# EAGLE design Esquema (EAGLE 9.6.2)
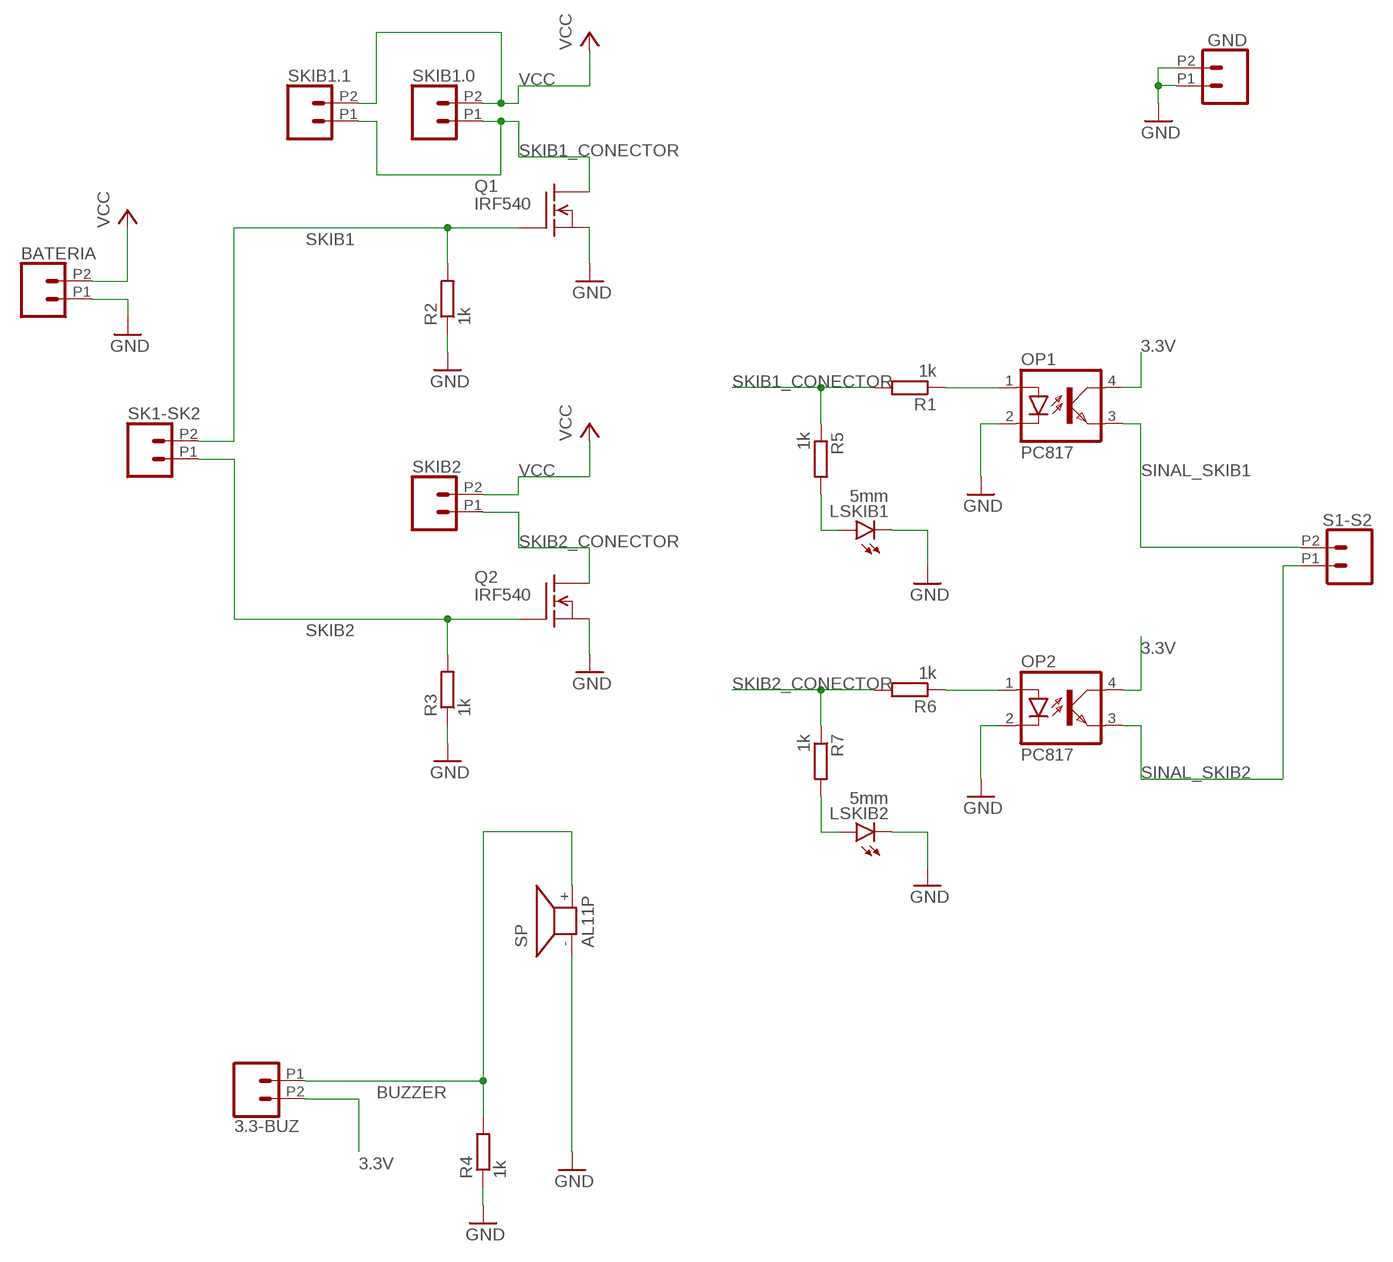
[diagram p0: schematic, sheet 1]

## Parts
3.3-BUZ  CONN_022.54MM_SCREWTERM  [1X02_2.54_SCREWTERM]
BATERIA  CONN_022.54MM_SCREWTERM  [1X02_2.54_SCREWTERM]
GND  CONN_022.54MM_SCREWTERM  [1X02_2.54_SCREWTERM]
LSKIB1  5mm  LED5MM  [LED5MM]
LSKIB2  5mm  LED5MM  [LED5MM]
OP1  PC817  [DIL04]
OP2  PC817  [DIL04]
Q1  IRF540  [TO220]
Q2  IRF540  [TO220]
R1  1k  R-EU_0207/10  [0207/10]
R2  1k  R-EU_0207/10  [0207/10]
R3  1k  R-EU_0207/10  [0207/10]
R4  1k  R-EU_0207/10  [0207/10]
R5  1k  R-EU_0207/10  [0207/10]
R6  1k  R-EU_0207/10  [0207/10]
R7  1k  R-EU_0207/10  [0207/10]
S1-S2  CONN_022.54MM_SCREWTERM  [1X02_2.54_SCREWTERM]
SK1-SK2  CONN_022.54MM_SCREWTERM  [1X02_2.54_SCREWTERM]
SKIB1.0  CONN_022.54MM_SCREWTERM  [1X02_2.54_SCREWTERM]
SKIB1.1  CONN_022.54MM_SCREWTERM  [1X02_2.54_SCREWTERM]
SKIB2  CONN_022.54MM_SCREWTERM  [1X02_2.54_SCREWTERM]
SP  AL11P  [AL11P]

## Nets
3.3V: 3.3-BUZ.P2 OP1.4(COL) OP2.4(COL)
BUZZER: 3.3-BUZ.P1 R4.2 SP.+
GND: BATERIA.P1 GND.P1 GND.P2 LSKIB1.K(C) LSKIB2.K(C) OP1.2(C) OP2.2(C) Q1.3(S) Q2.3(S) R2.1 R3.1 R4.1 SP.-
N$1: LSKIB2.A R7.2
N$3: LSKIB1.A R5.2
N$4: OP1.1(A) R1.1
N$5: OP2.1(A) R6.1
SINAL_SKIB1: OP1.3(EMIT) S1-S2.P2
SINAL_SKIB2: OP2.3(EMIT) S1-S2.P1
SKIB1: Q1.1(G) R2.2 SK1-SK2.P2
SKIB1_CONECTOR: Q1.2(D) R1.2 R5.1 SKIB1.0.P1 SKIB1.1.P1
SKIB2: Q2.1(G) R3.2 SK1-SK2.P1
SKIB2_CONECTOR: Q2.2(D) R6.2 R7.1 SKIB2.P1
VCC: BATERIA.P2 SKIB1.0.P2 SKIB1.1.P2 SKIB2.P2

## Library data of the parts
3.3-BUZ BATERIA GND S1-S2 SK1-SK2 SKIB1.0 SKIB1.1 SKIB2 = SparkFun-Connectors:CONN_02: Multi connection point. Often used as Generic Header-pin footprint for 0.1 inch spaced/style header connections On any of the 0.1 inch spaced packages, you can populate with these: Break Away Headers - Straight <https://www.sparkfun.com/products/116> (PRT-00116) Break Away Male Headers - Right Angle <https://www.sparkfun.com/products/553> (PRT-00553) Female Headers <https://www.sparkfun.com/products/115> (PRT-00115) Break Away Headers - Machine Pin <https://www.sparkfun.com/products/117> (PRT-00117) Break Away Female Headers - Swiss Machine Pin <https://www.sparkfun.com/products/743> (PRT-00743) For SCREWTERMINALS and SPRING TERMINALS visit here: Screw Terimnals on SparkFun.com <https://www.sparkfun.com/search/results?term=Screw+Terminals> (5mm/3.5mm/2.54mm spacing) This device is also useful as a general connection point to wire up your design to another part of your project. Our various solder wires solder well into these plated through hole pads. Hook-Up Wire - Assortment (Stranded, 22 AWG) <https://www.sparkfun.com/products/11375> (PRT-11375) Hook-Up Wire - Assortment (Solid Core, 22 AWG) <https://www.sparkfun.com/products/11367> (PRT-11367) View the entire wire category on our website here <https://www.sparkfun.com/categories/141> Special notes: Molex polarized connector foot print use with: PRT-08233 with associated crimp pins and housings. 2.54_SCREWTERM for use with PRT-10571. 3.5mm Screw Terminal footprints for PRT-08084 5mm Screw Terminal footprints for use with PRT-08432
LSKIB1 LSKIB2 = led:LED: LED OSRAM: - CHIPLED LG R971, LG N971, LY N971, LG Q971, LY Q971, LO R971, LY R971 LH N974, LH R974 LS Q976, LO Q976, LY Q976 LO Q996 - Hyper CHIPLED LW Q18S LB Q993, LB Q99A, LB R99A - SideLED LS A670, LO A670, LY A670, LG A670, LP A670 LB A673, LV A673, LT A673, LW A673 LH A674 LY A675 LS A676, LA A676, LO A676, LY A676, LW A676 LS A679, LY A679, LG A679 - Hyper Micro SIDELED® LS Y876, LA Y876, LO Y876, LY Y876 LT Y87S - SmartLED LW L88C, LW L88S LB L89C, LB L89S, LG L890 LS L89K, LO L89K, LY L89K LS L896, LA L896, LO L896, LY L896 - TOPLED LS T670, LO T670, LY T670, LG T670, LP T670 LSG T670, LSP T670, LSY T670, LOP T670, LYG T670 LG T671, LOG T671, LSG T671 LB T673, LV T673, LT T673, LW T673 LH T674 LS T676, LA T676, LO T676, LY T676, LB T676, LH T676, LSB T676, LW T676 LB T67C, LV T67C, LT T67C, LS T67K, LO T67K, LY T67K, LW E67C LS E67B, LA E67B, LO E67B, LY E67B, LB E67C, LV E67C, LT E67C LW T67C LS T679, LY T679, LG T679 LS T770, LO T770, LY T770, LG T770, LP T770 LB T773, LV T773, LT T773, LW T773 LH T774 LS E675, LA E675, LY E675, LS T675 LS T776, LA T776, LO T776, LY T776, LB T776 LHGB T686 LT T68C, LB T68C - Hyper Mini TOPLED® LB M676 - Mini TOPLED Santana® LG M470 LS M47K, LO M47K, LY M47K Source: http://www.osram.convergy.de LUXEON: - LUMILED® LXK2-PW12-R00, LXK2-PW12-S00, LXK2-PW14-U00, LXK2-PW14-V00 LXK2-PM12-R00, LXK2-PM12-S00, LXK2-PM14-U00 LXK2-PE12-Q00, LXK2-PE12-R00, LXK2-PE12-S00, LXK2-PE14-T00, LXK2-PE14-U00 LXK2-PB12-K00, LXK2-PB12-L00, LXK2-PB12-M00, LXK2-PB14-N00, LXK2-PB14-P00, LXK2-PB14-Q00 LXK2-PR12-L00, LXK2-PR12-M00, LXK2-PR14-Q00, LXK2-PR14-R00 LXK2-PD12-Q00, LXK2-PD12-R00, LXK2-PD12-S00 LXK2-PH12-R00, LXK2-PH12-S00 LXK2-PL12-P00, LXK2-PL12-Q00, LXK2-PL12-R00 Source: www.luxeon.com KINGBRIGHT: KA-3528ASYC Source: www.kingbright.com
OP1 OP2 = optocoupler:PC817: SHARP OPTO COUPLER; MPN: PC817X4J000F; OC_FARNELL: 9707727; OC_NEWARK: 97K7059
Q1 Q2 = transistor-fet:IRF540: N-Channel Enhancement MOSFET (HEXFET); 100V; 28A; 0,077Ohm
R1-R7 = rcl:R-EU_: RESISTOR, European symbol; SPICEPREFIX: R
SP = buzzer:AL11P: SPEAKER Source: Buerklin; OC_FARNELL: unknown; OC_NEWARK: unknown

## Board
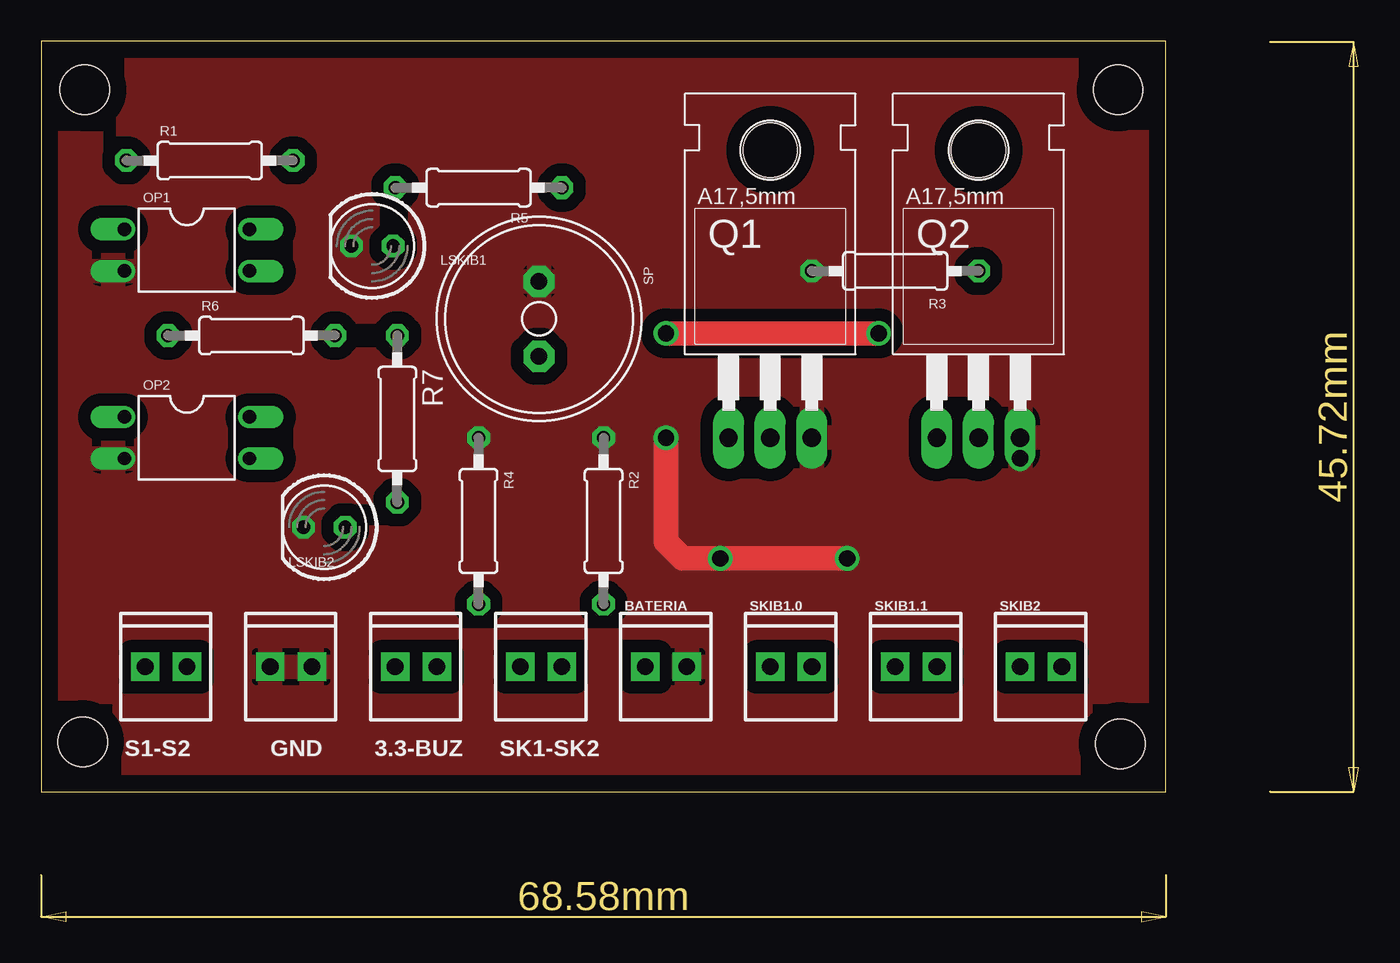
[diagram p1: board, top side]
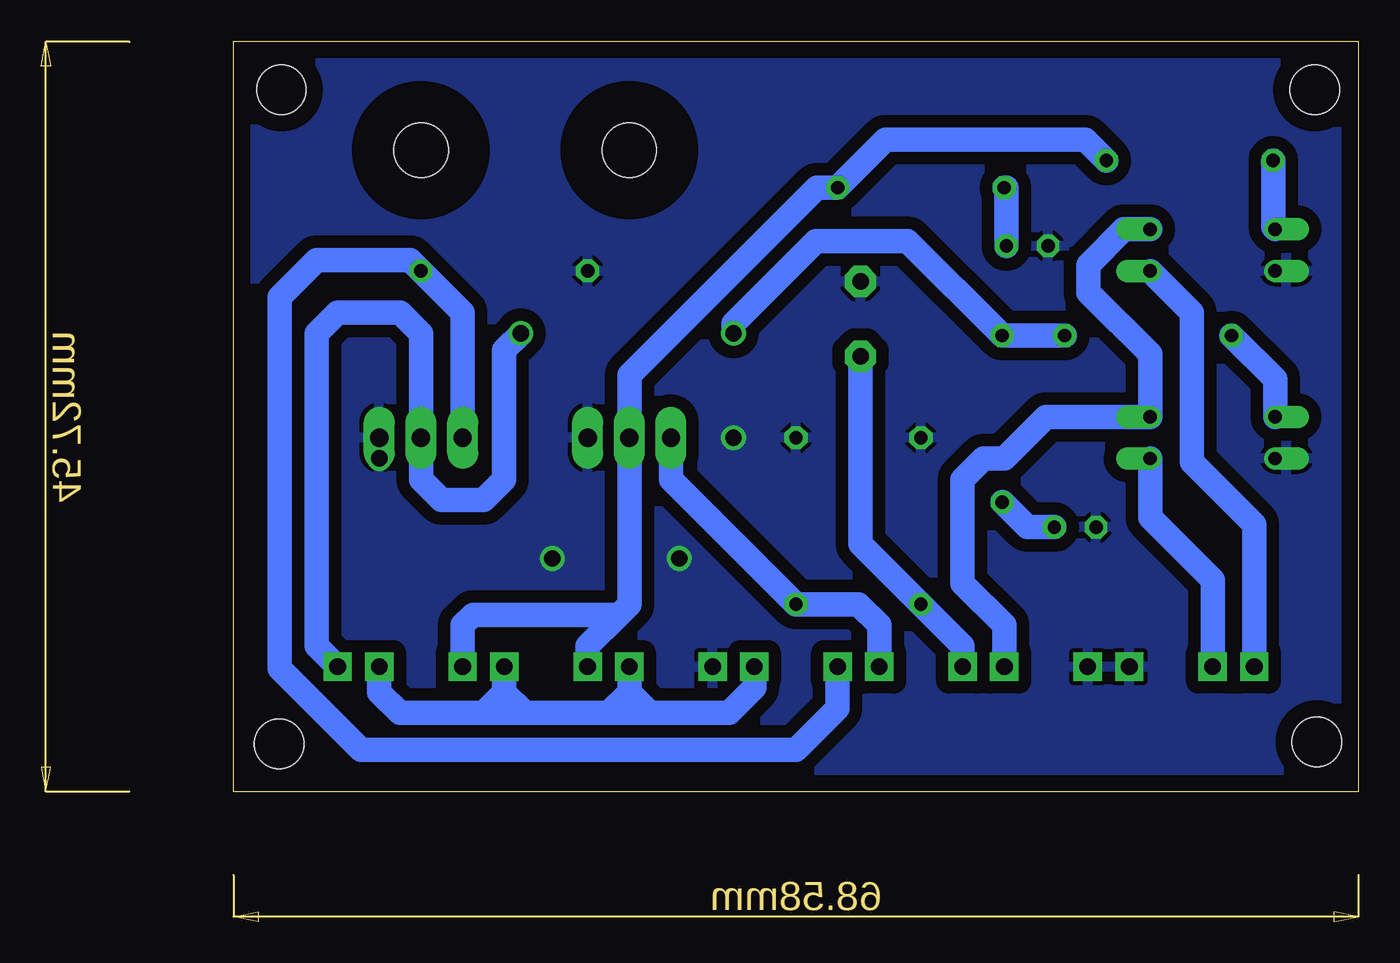
[diagram p2: board, bottom side, seen from below]

Size 68.56 x 45.77 mm. Coordinates in mm from the lower left corner, seen from the top.
Outline: 0,0 68.56,0 68.56,45.77 0,45.77 0,0
Copper layers (1*16): Top 0.035mm / dielectric 1.5mm / Bottom 0.035mm
Design rules "default": minimum track width 1.5mm, minimum drill 1mm, track to track 30mil, track to pad 20mil, pad to pad 6mil, via to via 6mil, smd to smd 6mil, copper to edge 40mil, drill to drill 6mil, minimum pad ring 10mil, minimum via ring 8mil, stop-mask expansion 4mil, vias tented up to drill 0mil, thermal gap 10mil
Holes 3 mm at 2.67,42.8 65.66,42.8 2.54,3.05 65.79,2.92

### Footprints (pad centres in the part's own frame; a part is rotated, then mirrored left to right if it is on the bottom)
1X02_2.54_SCREWTERM = drill 1.016 square: P1 2.54,0; P2 0,0
LED5MM = drill 0.813 octagon: A -1.27,0; K 1.27,0
DIL04 = drill 0.813 offset: 1 -1.27,-3.81; 2 1.27,-3.81; 3 1.27,3.81; 4 -1.27,3.81
TO220 = drill 1.118 long: 1 -2.54,-6.35; 2 0,-6.35; 3 2.54,-6.35 | hole 3.302: 0,11.176
0207/10 = drill 0.813 octagon: 1 -5.08,0; 2 5.08,0
AL11P = drill 1.016 pad 1.905 octagon: + 2.286,0; - -2.286,0

### Placement (x,y rotation side)
3.3-BUZ  21.59,7.62 0 top
BATERIA  36.83,7.62 0 top
GND  13.97,7.62 0 top
LSKIB1  20.19,33.27 180 top
LSKIB2  17.27,16.13 180 top
OP1  8.89,33.02 270 top
OP2  8.89,21.59 270 top
Q1  44.45,27.94 0 top
Q2  57.15,27.94 0 top
R1  10.29,38.48 0 top
R2  34.29,16.51 270 top
R3  52.07,31.75 0 top
R4  26.67,16.51 270 top
R5  26.67,36.83 180 top
R6  12.83,27.81 0 top
R7  21.72,22.73 270 top
S1-S2  6.35,7.62 0 top
SK1-SK2  29.21,7.62 0 top
SKIB1.0  44.45,7.62 0 top
SKIB1.1  52.07,7.62 0 top
SKIB2  59.69,7.62 0 top
SP  30.35,28.83 270 top

### Tracks (layer width: path | path; a pad name or v marks a point on that pad's centre or on a via)
3.3V
  Bottom 1.5: OP1.4 14.3,34.29 16.46,32.12 16.46,30.43 12.7,26.67 OP2.4 19.05,22.86 21.59,20.32 22.86,20.32 24.13,19.05 24.13,12.7 21.59,10.16 3.3-BUZ.P2
BUZZER
  Bottom 1.5: SP.+ 30.35,15.11 R4.2 24.13,8.89 3.3-BUZ.P1
GND  (via drill 1)
  Top 1.5: v38.1,21.59 38.1,15.24 39.12,14.22 v41.4,14.22 v49.15,14.22
  other vias: 59.69,20.32
  pour Bottom: 0.38,45.34 0.38,0.38 68.2,0.38 68.2,45.34
  pour Top: 0,45.72 0,0 68.58,0 68.58,45.72
N$1
  Bottom 1.5: LSKIB2.A 20.19,16.13 R7.2
N$3
  Bottom 1.5: LSKIB1.A 21.46,36.83 R5.2
N$4
  Bottom 1.5: R1.1 5.21,34.42 OP1.1
N$5
  Bottom 1.5: OP2.1 5.08,25.15 R6.1
SINAL_SKIB1
  Bottom 1.5: S1-S2.P2 6.35,16.29 10.16,20.1 10.16,29.21 OP1.3
SINAL_SKIB2
  Bottom 1.5: OP2.3 12.7,16.73 8.89,12.92 S1-S2.P1
SKIB1
  Bottom 1.5: Q1.1 41.91,19.05 R2.2 30.48,11.43 29.21,10.16 SK1-SK2.P2
SKIB1_CONECTOR
  Bottom 1.5: R1.2 16.64,39.75 28.83,39.75 R5.1 33.02,36.83 44.45,25.4 Q1.2 44.45,11.43 45.09,10.79 | SKIB1.0.P1 46.99,8.89 45.09,10.79 | 45.09,10.79 53.98,10.79 54.61,10.16 SKIB1.1.P1
SKIB2
  Bottom 1.5: Q2.1 54.61,29.21 R3.2 57.81,32.41 63.5,32.41 65.76,30.15 65.76,7.52 60.79,2.54 34.29,2.54 31.75,5.08 SK1-SK2.P1
SKIB2_CONECTOR  (via drill 1)
  Top 1.5: v38.1,27.94 v51.05,27.94
  Bottom 1.5: R6.2 R7.1 27.48,33.58 33.07,33.58 38.1,28.55 v38.1,27.94 | SKIB2.P1 63.5,8.89 63.5,27.94 62.23,29.21 58.42,29.21 57.15,27.94 Q2.2 57.15,19.05 55.88,17.78 53.34,17.78 52.07,19.05 52.07,26.92 v51.05,27.94
VCC
  Bottom 1.5: SKIB2.P2 59.69,6.07 58.42,4.8 53.34,4.8 | BATERIA.P2 36.83,6.35 38.38,4.8 43.18,4.8 | 43.18,4.8 45.72,4.8 | 45.72,4.8 50.8,4.8 | 50.8,4.8 53.34,4.8 | 43.18,4.8 44.45,6.07 | SKIB1.0.P2 44.45,6.07 | 44.45,6.07 45.72,4.8 | 50.8,4.8 52.07,6.07 | 52.07,6.07 SKIB1.1.P2 | 52.07,6.07 53.34,4.8